# Altium schematic sheet HandheldCon.SchDoc
size A3
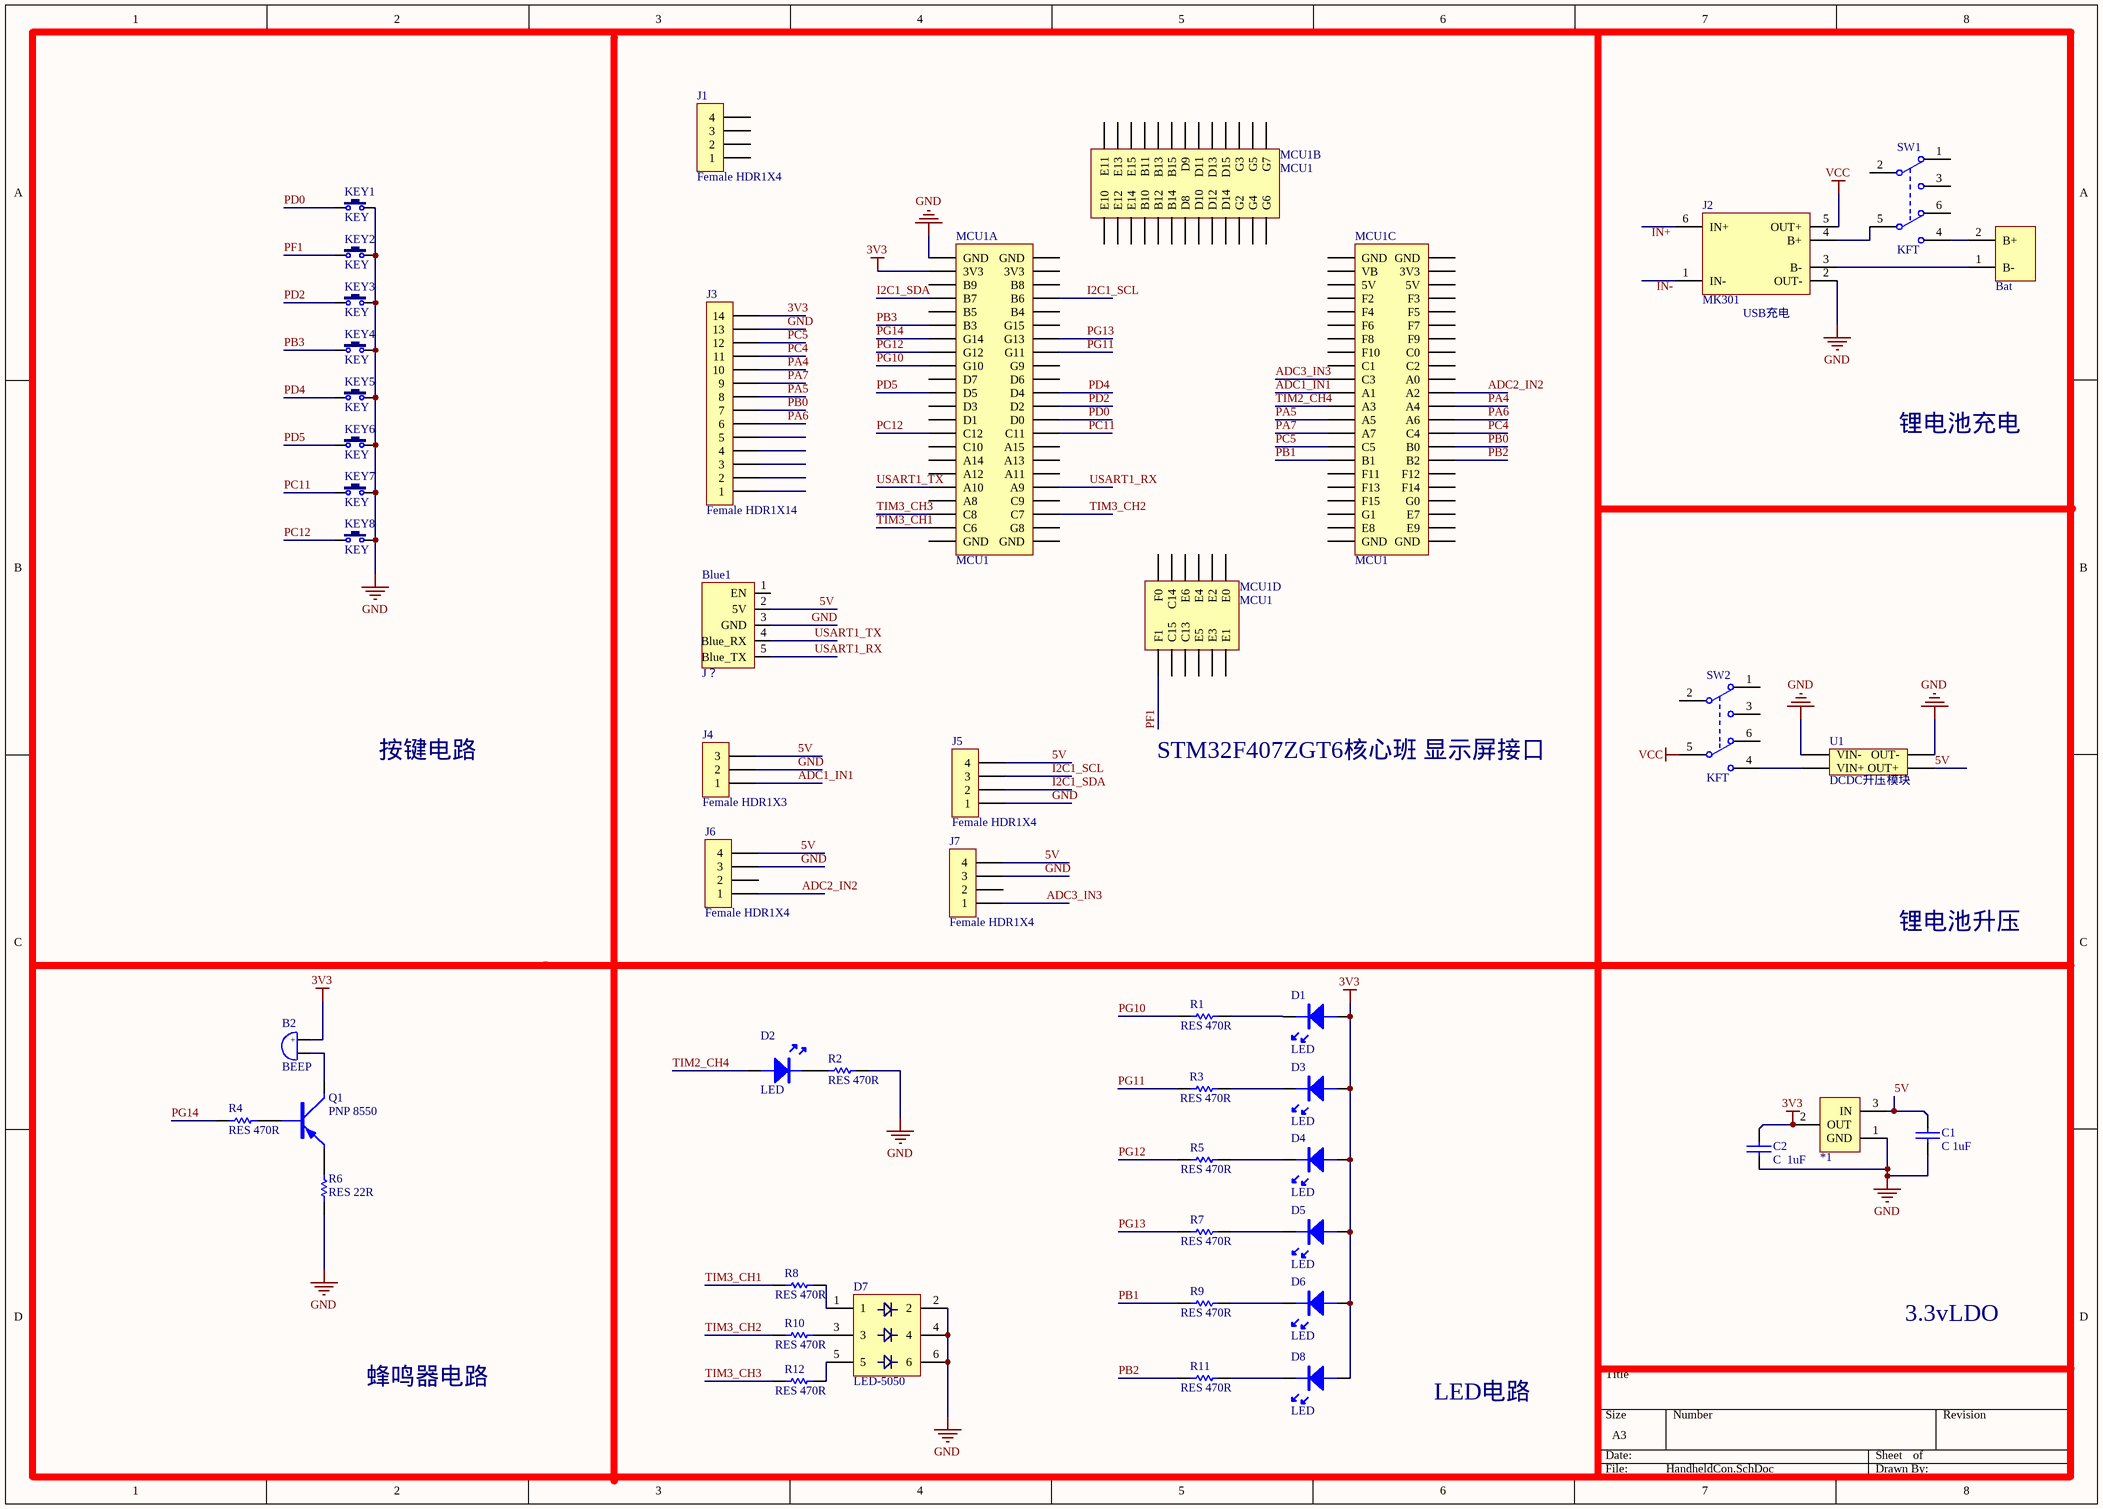
[diagram p0: HandheldCon.SchDoc]

## Parts
*1  3Vout  [ASM1117_3.3V]  (value not drawn)
B1  Bat  [XH2.54-LI-2P]
B2  BEEP  [BEEP 5x9x5.5]
Blue1  J？  [HDR2.54-M-LI-5P]
C1  C 1uF  [1206C]
C2  C  1uF  [1206C]
D1  LED  [LED-0805R]
D2  LED  [LED-0805R]
D3  LED  [LED-0805Y]
D4  LED  [LED-0805B]
D5  LED  [LED-0805G]
D6  LED  [LED-0805G]
D7  LED-5050  [LED-5050W]
D8  LED  [LED-0805G]
J1  Female HDR1X4  [Fe-HDR1X4/2.54-S]
J2  MK301  [TP4056]
J3  Female HDR1X14  [Fe-HDR1X14/2.54-S]
J4  Female HDR1X3  [Fe-HDR1X3/2.54-S]
J5  Female HDR1X4  [Fe-HDR1X4/2.54-S]
J6  Female HDR1X4  [Fe-HDR1X4/2.54-S]
J7  Female HDR1X4  [Fe-HDR1X4/2.54-S]
KEY1  KEY  [TSW SMD-6*6*8]
KEY2  KEY  [TSW SMD-6*6*8]
KEY3  KEY  [TSW SMD-6*6*8]
KEY4  KEY  [TSW SMD-6*6*8]
KEY5  KEY  [TSW SMD-6*6*8]
KEY6  KEY  [TSW SMD-6*6*8]
KEY7  KEY  [TSW SMD-6*6*8]
KEY8  KEY  [TSW SMD-6*6*8]
MCU1  MCU1  [核心板底座]  (parts A,B,C,D of 4)
Q1  PNP 8550  [SOT-23]
R1  RES 470R  [0805R]
R2  RES 470R  [0805R]
R3  RES 470R  [0805R]
R4  RES 470R  [0805R]
R5  RES 470R  [0805R]
R6  RES 22R  [0805R]
R7  RES 470R  [0805R]
R8  RES 470R  [0805R]
R9  RES 470R  [0805R]
R10  RES 470R  [0805R]
R11  RES 470R  [0805R]
R12  RES 470R  [0805R]
SW1  KFT  [KFT DIP-7X7]
SW2  KFT  [KFT DIP-7X7]
U1  DCDC升压模块  [DCDC升压5V]

## Nets
3V3: *1.2(OUT) B2.1 C2.1 D1.A D3.A D4.A D5.A D6.A D8.A J3.14 MCU1.3(3V3)
GND: *1.1(GND) Blue1.3(GND) C1.2 C2.2 D7.2 D7.4 D7.6 J2.2(OUT-) J3.13 J4.2 J5.1 J6.3 J7.3 KEY1.2 KEY2.2 KEY3.2 KEY4.2 KEY5.2 KEY6.2 KEY7.2 KEY8.2 MCU1.1(GND) R2.1 R6.2 U1.2(OUT-) U1.3(VIN-)
VCC: J2.5(OUT+) SW2.5(COM2)
5V: *1.3(IN) Blue1.2(5V) C1.1 J4.3 J5.4 J6.4 J7.4 U1.1(OUT+)
ADC1_IN1: J4.1 MCU1.94(A1)
ADC2_IN2: J6.1 MCU1.93(A2)
ADC3_IN3: J7.1 MCU1.96(C3)
I2C1_SCL: J5.3 MCU1.8(B6)
I2C1_SDA: J5.2 MCU1.7(B7)
PA4: J3.10 MCU1.91(A4)
PA5: J3.8 MCU1.90(A5)
PA6: J3.6 MCU1.89(A6)
PA7: J3.9 MCU1.88(A7)
PB0: J3.7 MCU1.85(B0)
PB1: MCU1.84(B1) R9.1
PB2: MCU1.83(B2) R11.1
PB3: KEY4.1 MCU1.11(B3)
PC4: J3.11 MCU1.87(C4)
PC5: J3.12 MCU1.86(C5)
PC11: KEY7.1 MCU1.28(C11)
PC12: KEY8.1 MCU1.27(C12)
PD0: KEY1.1 MCU1.26(D0)
PD2: KEY3.1 MCU1.24(D2)
PD4: KEY5.1 MCU1.22(D4)
PD5: KEY6.1 MCU1.21(D5)
PF1: KEY2.1 MCU1.115(F1)
PG10: MCU1.17(G10) R1.1
PG11: MCU1.16(G11) R3.1
PG12: MCU1.15(G12) R5.1
PG13: MCU1.14(G13) R7.1
PG14: MCU1.13(G14) R4.2
TIM2_CH4: D2.A MCU1.92(A3)
TIM3_CH1: MCU1.41(C6) R8.1
TIM3_CH2: MCU1.40(C7) R10.1
TIM3_CH3: MCU1.39(C8) R12.1
USART1_RX: Blue1.5(Blue_TX) MCU1.36(A9)
USART1_TX: Blue1.4(Blue_RX) MCU1.35(A10)
NetB1_1: B1.1(B-) J2.3(B-)
NetB1_2: B1.2(B+) SW1.4(NO2)
NetB2_2: B2.2 Q1.C
NetD1_K: D1.K R1.2
NetD2_K: D2.K R2.2
NetD3_K: D3.K R3.2
NetD4_K: D4.K R5.2
NetD5_K: D5.K R7.2
NetD6_K: D6.K R9.2
NetD7_1: D7.1 R8.2
NetD7_3: D7.3 R10.2
NetD7_5: D7.5 R12.2
NetD8_K: D8.K R11.2
NetJ2_4: J2.4(B+) SW1.5(COM2)
NetQ1_B: Q1.B R4.1
NetQ1_E: Q1.E R6.1
NetSW2_4: SW2.4(NO2) U1.4(VIN+)

Not connected (* = marked no-connect by the designer): Blue1 1(EN); J1 1 2 3 4; J2 1(IN-) 6(IN+); J3 1 2 3 4 5; J6 2; J7 2; MCU1 2(GND) 4(3V3) 5(B9) 6(B8) 9(B5) 10(B4) 12(G15) 18(G9) 19(D7) 20(D6) 23(D3) 25(D1) 29(C10) 30(A15) 31(A14) 32(A13) 33(A12) 34(A11) 37(A8) 38(C9) 42(G8) 43(GND) 44(GND) 45(G7) 46(G6) 47(G5) 48(G4) 49(G3) 50(G2) 51(D15) 52(D14) 53(D13) 54(D12) 55(D11) 56(D10) 57(D9) 58(D8) 59(B15) 60(B14) 61(B13) 62(B12) 63(B11) 64(B10) 65(E15) 66(E14) 67(E13) 68(E12) 69(E11) 70(E10) 71(GND) 72(GND) 73(E9) 74(E8) 75(E7) 76(G1) 77(G0) 78(F15) 79(F14) 80(F13) 81(F12) 82(F11) 95(A0) 97(C2) 98(C1) 99(C0) 100(F10) 101(F9) 102(F8) 103(F7) 104(F6) 105(F5) 106(F4) 107(F3) 108(F2) 109(5V) 110(5V) 111(3V3) 112(VB) 113(GND) 114(GND) 116(F0) 117(C15) 118(C14) 119(C13) 120(E6) 121(E5) 122(E4) 123(E3) 124(E2) 125(E1) 126(E0); SW1 1(NC1) 2(COM2) 3(NO1) 6(NC2); SW2 1(NC1) 2(COM2) 3(NO1) 6(NC2)

## Notes on the sheet
- (near J2) USB充电
- 锂电池充电
- 按键电路
- STM32F407ZGT6核心班 显示屏接口
- 锂电池升压
- 3.3vLDO
- 蜂鸣器电路
- LED电路
- Labels drawn without touching a wire or pin: IN+, IN-
- (in symbol BEEP) +

## Library data of the parts
*1 = LM1117
B1 = Bettry
B2 = BEEP: 蜂鸣器
Blue1 = BlueTooth_net
C1 C2 = CAP1206: Capacitor
KEY1-KEY8 = TSW_6X6-SMT: Tact Switch
MCU1 = 核心板插座
Q1 = PNP: PNP三极管
R1-R12 = RES
SW1 SW2 = KFT_7X7-DIP: Self-locking Switch